# Altium project garage.PrjPcb
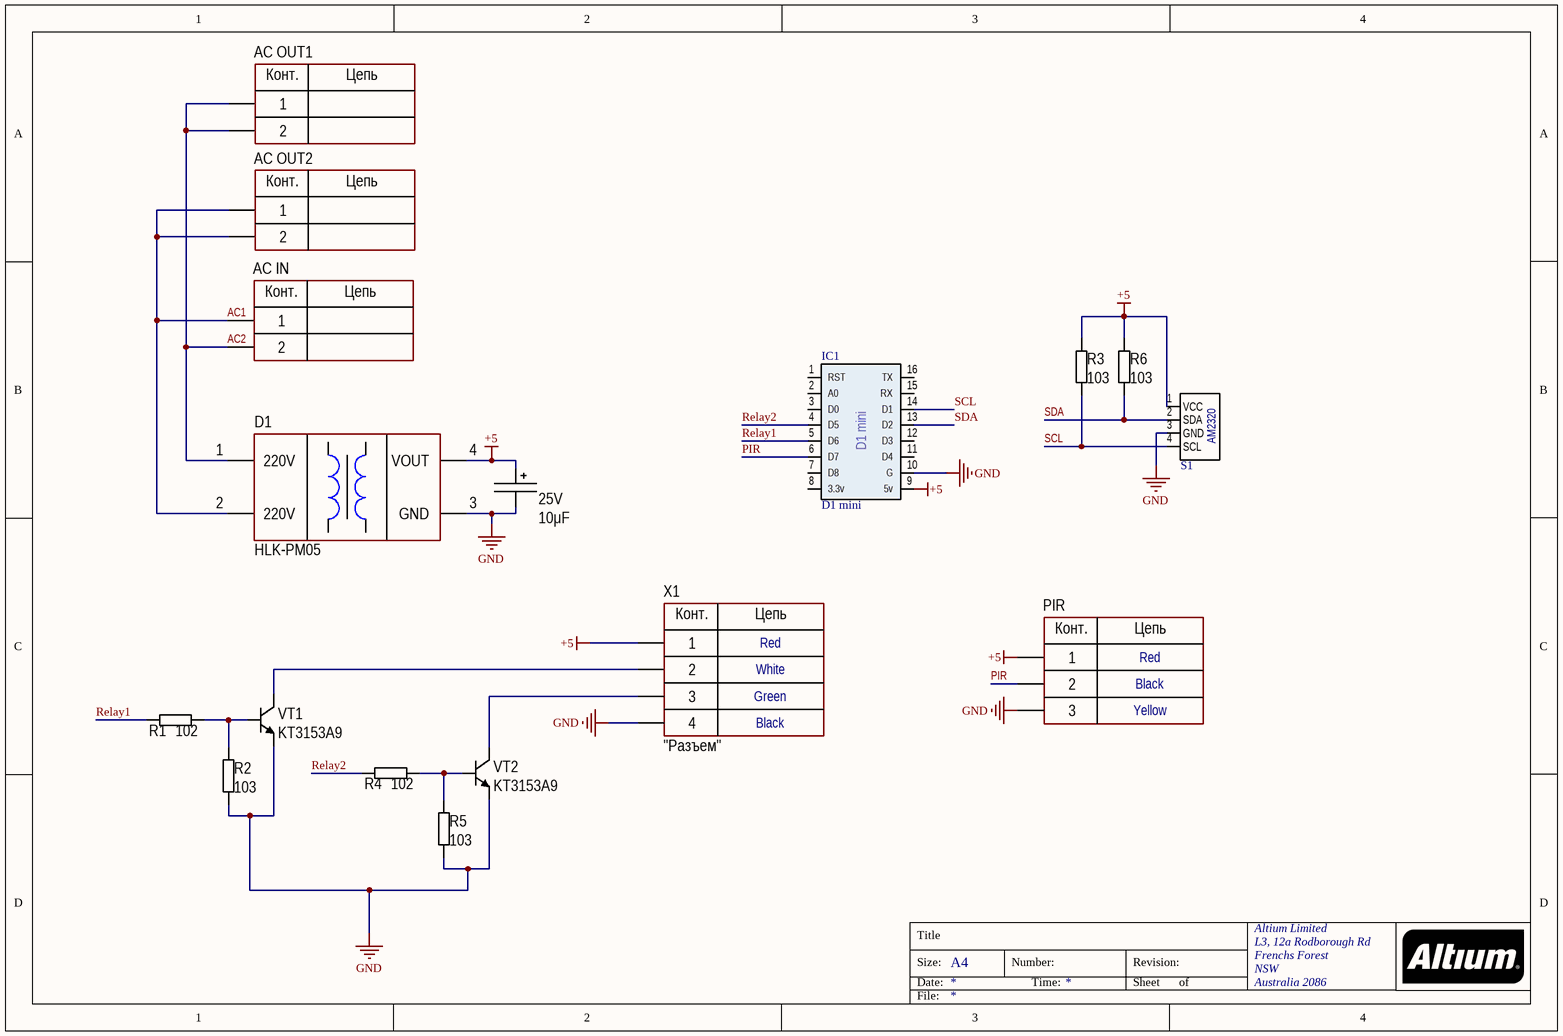
[diagram p0: Sheet1.SchDoc]
1 sheet, 17 parts. Net scope: global (net labels, ports and power ports of the same name join across sheets).
Board files: PCB1.PcbDoc, PCB2.PcbDoc, PCB3.PcbDoc

## Sheet Sheet1.SchDoc
size A4; Organization: Altium Limited; Address1: L3, 12a Rodborough Rd; Address2: Frenchs Forest; Address3: NSW; Address4: Australia 2086

### Parts
AC_IN  (no value)  [CON: 0395430002 (5 mm)]
AC_OUT1  (no value)  [CON: 0395430002 (5 mm)]
AC_OUT2  (no value)  [CON: 0395430002 (5 mm)]
C1  value 10μF  Voltage: 25V  [CAP: D6.3C2.5H11]
D1  (no value)  [MOD: HLK-PM01]
IC1  D1 mini  [D1_mini]
PIR  (no value)  [CON: CWF-3]
R1  value 102  [RES: 0805]
R2  value 103  [RES: 0805]
R3  value 103  [RES: 0805]
R4  value 102  [RES: 0805]
R5  value 103  [RES: 0805]
R6  value 103  [RES: 0805]
S1  AM2320  [AM2320]  (value not drawn)
VT1  PartNumber: KT3153A9  [SOT23]
VT2  PartNumber: KT3153A9  [SOT23]
X1  CommentText: "Разъем"  [CON: CWF-4]

### Nets
+5: C1.1 D1.4(VOUT) IC1.9(5v) PIR.1 R3.2 R6.2 S1.1(VCC) X1.1
GND: C1.2 D1.3(GND) IC1.10(G) PIR.3 R2.1 R5.1 S1.3(GND) VT1.2(E) VT2.2(E) X1.4
AC1: AC_IN.1 AC_OUT2.1 AC_OUT2.2 D1.2(220V)
AC2: AC_IN.2 AC_OUT1.1 AC_OUT1.2 D1.1(220V)
PIR: IC1.6(D7) PIR.2
Relay1: IC1.5(D6) R1.1
Relay2: IC1.4(D5) R4.1
SCL: IC1.14(D1) R3.1 S1.4(SCL)
SDA: IC1.13(D2) R6.1 S1.2(SDA)
NetR1_2: R1.2 R2.2 VT1.1(B)
NetR4_2: R4.2 R5.2 VT2.1(B)
NetVT1_3: VT1.3(C) X1.2
NetVT2_3: VT2.3(C) X1.3

Not connected (* = marked no-connect by the designer): IC1 1(RST) 2(A0) 3(D0) 7(D8) 8(3.3v) 11(D4) 12(D3) 15(RX) 16(TX)

### Notes on the sheet
- Title
- Size:
- Date:
- A4
- Number:
- Time:
- Revision:
- Sheet
- of
- File:
- (in symbol Connector_terminal_2pin) Конт.; Цепь
- (in symbol CWF-3) Конт.; Цепь; Red; Black; Yellow
- (in symbol CWF-4) Конт.; Цепь; Red; White; Green; Black

### Library data of the parts
AC_IN AC_OUT1 AC_OUT2 = Connector_terminal_2pin: Manufacturer: Degson; ValueManufacturerPartNumber: Terminal connector, 2pin, 3.5mm, 300VAC, 10A; PartNumber: DG350-3.5-02P-14; TypeConnector: Terminal connector; VoltageMax: 300VAC; Pitch: 3.5mm; CurrentMax: 10A; Multichannel: 2pin; CommentText: AC IN; HelpURL: https://www.chipdip.ru/product/dg350-3.5-02p-12
C1 = Aluminium: Manufacturer: Wurth; PartNumber: 860080475013; ValueManufacturerPartNumber: Aluminium capacitor, 10μF, 25V, ±20%, 54mOhm, 14x10x5 mm, -55...+105°C; TypeCapacitor: Aluminium capacitor; Tolerance: ±20%; Impedance: 54mOhm; Package: 14x10x5 mm; HelpURL: https://www.digikey.com/product-detail/en/wurth-electronics-inc/860080475013/732-9029-1-ND/5728972; Temperature: -55...+105°C
D1 = HLK-PM05: AC/DC converter; Manufacturer: Mornsun; ValueManufacturerPartNumber: AC/DC converter, isolator, 3V 900mA, 100...240VAC, -40...+105°C, 30x20x15mm; OutputType: isolator; OutputVoltage: 3V 900mA; InputVoltage: 100...240VAC; HelpURL: https://ru.aliexpress.com/item/32408565688.html; Package: 30x20x15mm; ComponentType: AC/DC converter; Temperature: -40...+105°C; PartNumber: HLK-PM05
PIR = CWF-3: Manufacturer: Connfly; ValueManufacturerPartNumber: Connector, 2pin, 2.54mm, 250VAC, 3A; PartNumber: CWF-2R; TypeConnector: Connector; VoltageMax: 250VAC; Pitch: 2.54mm; CurrentMax: 3A; Multichannel: 2pin; CommentText: "Разъем"; HelpURL: https://www.chipdip.ru/product/cwf-2r-ds1069-2-mr
R1 R4 = Resistor_0805: Manufacturer: Yageo; PartNumber: RC0805JR-07100RL; ValueManufacturerPartNumber: Resistor film, 102, ±5%, 0805, 0.125W, -55...+125°C; TypeResistor: Resistor film; Power: 0.125W; Tolerance: ±5%; Package: 0805; HelpURL: https://www.digikey.com/product-detail/en/yageo/RC0805JR-07100RL/311-100ARCT-ND/731185; Temperature: -55...+125°C
R2 R3 R5 R6 = Resistor_0805: Manufacturer: Yageo; PartNumber: RC0805JR-07100RL; ValueManufacturerPartNumber: Resistor film, 103, ±5%, 0805, 0.125W, -55...+125°C; TypeResistor: Resistor film; Power: 0.125W; Tolerance: ±5%; Package: 0805; HelpURL: https://www.digikey.com/product-detail/en/yageo/RC0805JR-07100RL/311-100ARCT-ND/731185; Temperature: -55...+125°C
VT1 VT2 = BJT_NPN_132: Manufacturer: ON Semiconductor; ValueManufacturerPartNumber: NPN transistor, 45V, 100mA, 100MHz, 300mW, 0.6V, 420, SOT-23, -55...+125°C; TypeTransistor: NPN transistor; VoltageCE: 45V; CurrentCE: 100mA; VoltageSaturation: 0.6V; Frequency: 100MHz; CurrentGain: 420; MaxPower: 300mW; Package: SOT-23; HelpURL: https://www.digikey.com/product-detail/en/on-semiconductor/BC847CLT1G/BC847CLT1GOSCT-ND/917836; Temperature: -55...+125°C
X1 = CWF-4: Manufacturer: Connfly; ValueManufacturerPartNumber: Connector, 4pin, 2.54mm, 250VAC, 3A; PartNumber: CWF-4R; TypeConnector: Connector; VoltageMax: 250VAC; Pitch: 2.54mm; CurrentMax: 3A; Multichannel: 4pin; HelpURL: https://www.chipdip.ru/product/cwf-4r-ds1069-4-mr